# Altium schematic sheet GPIOs RPI CM.SchDoc
size A3; SheetNumber: 1; SheetTotal: 11
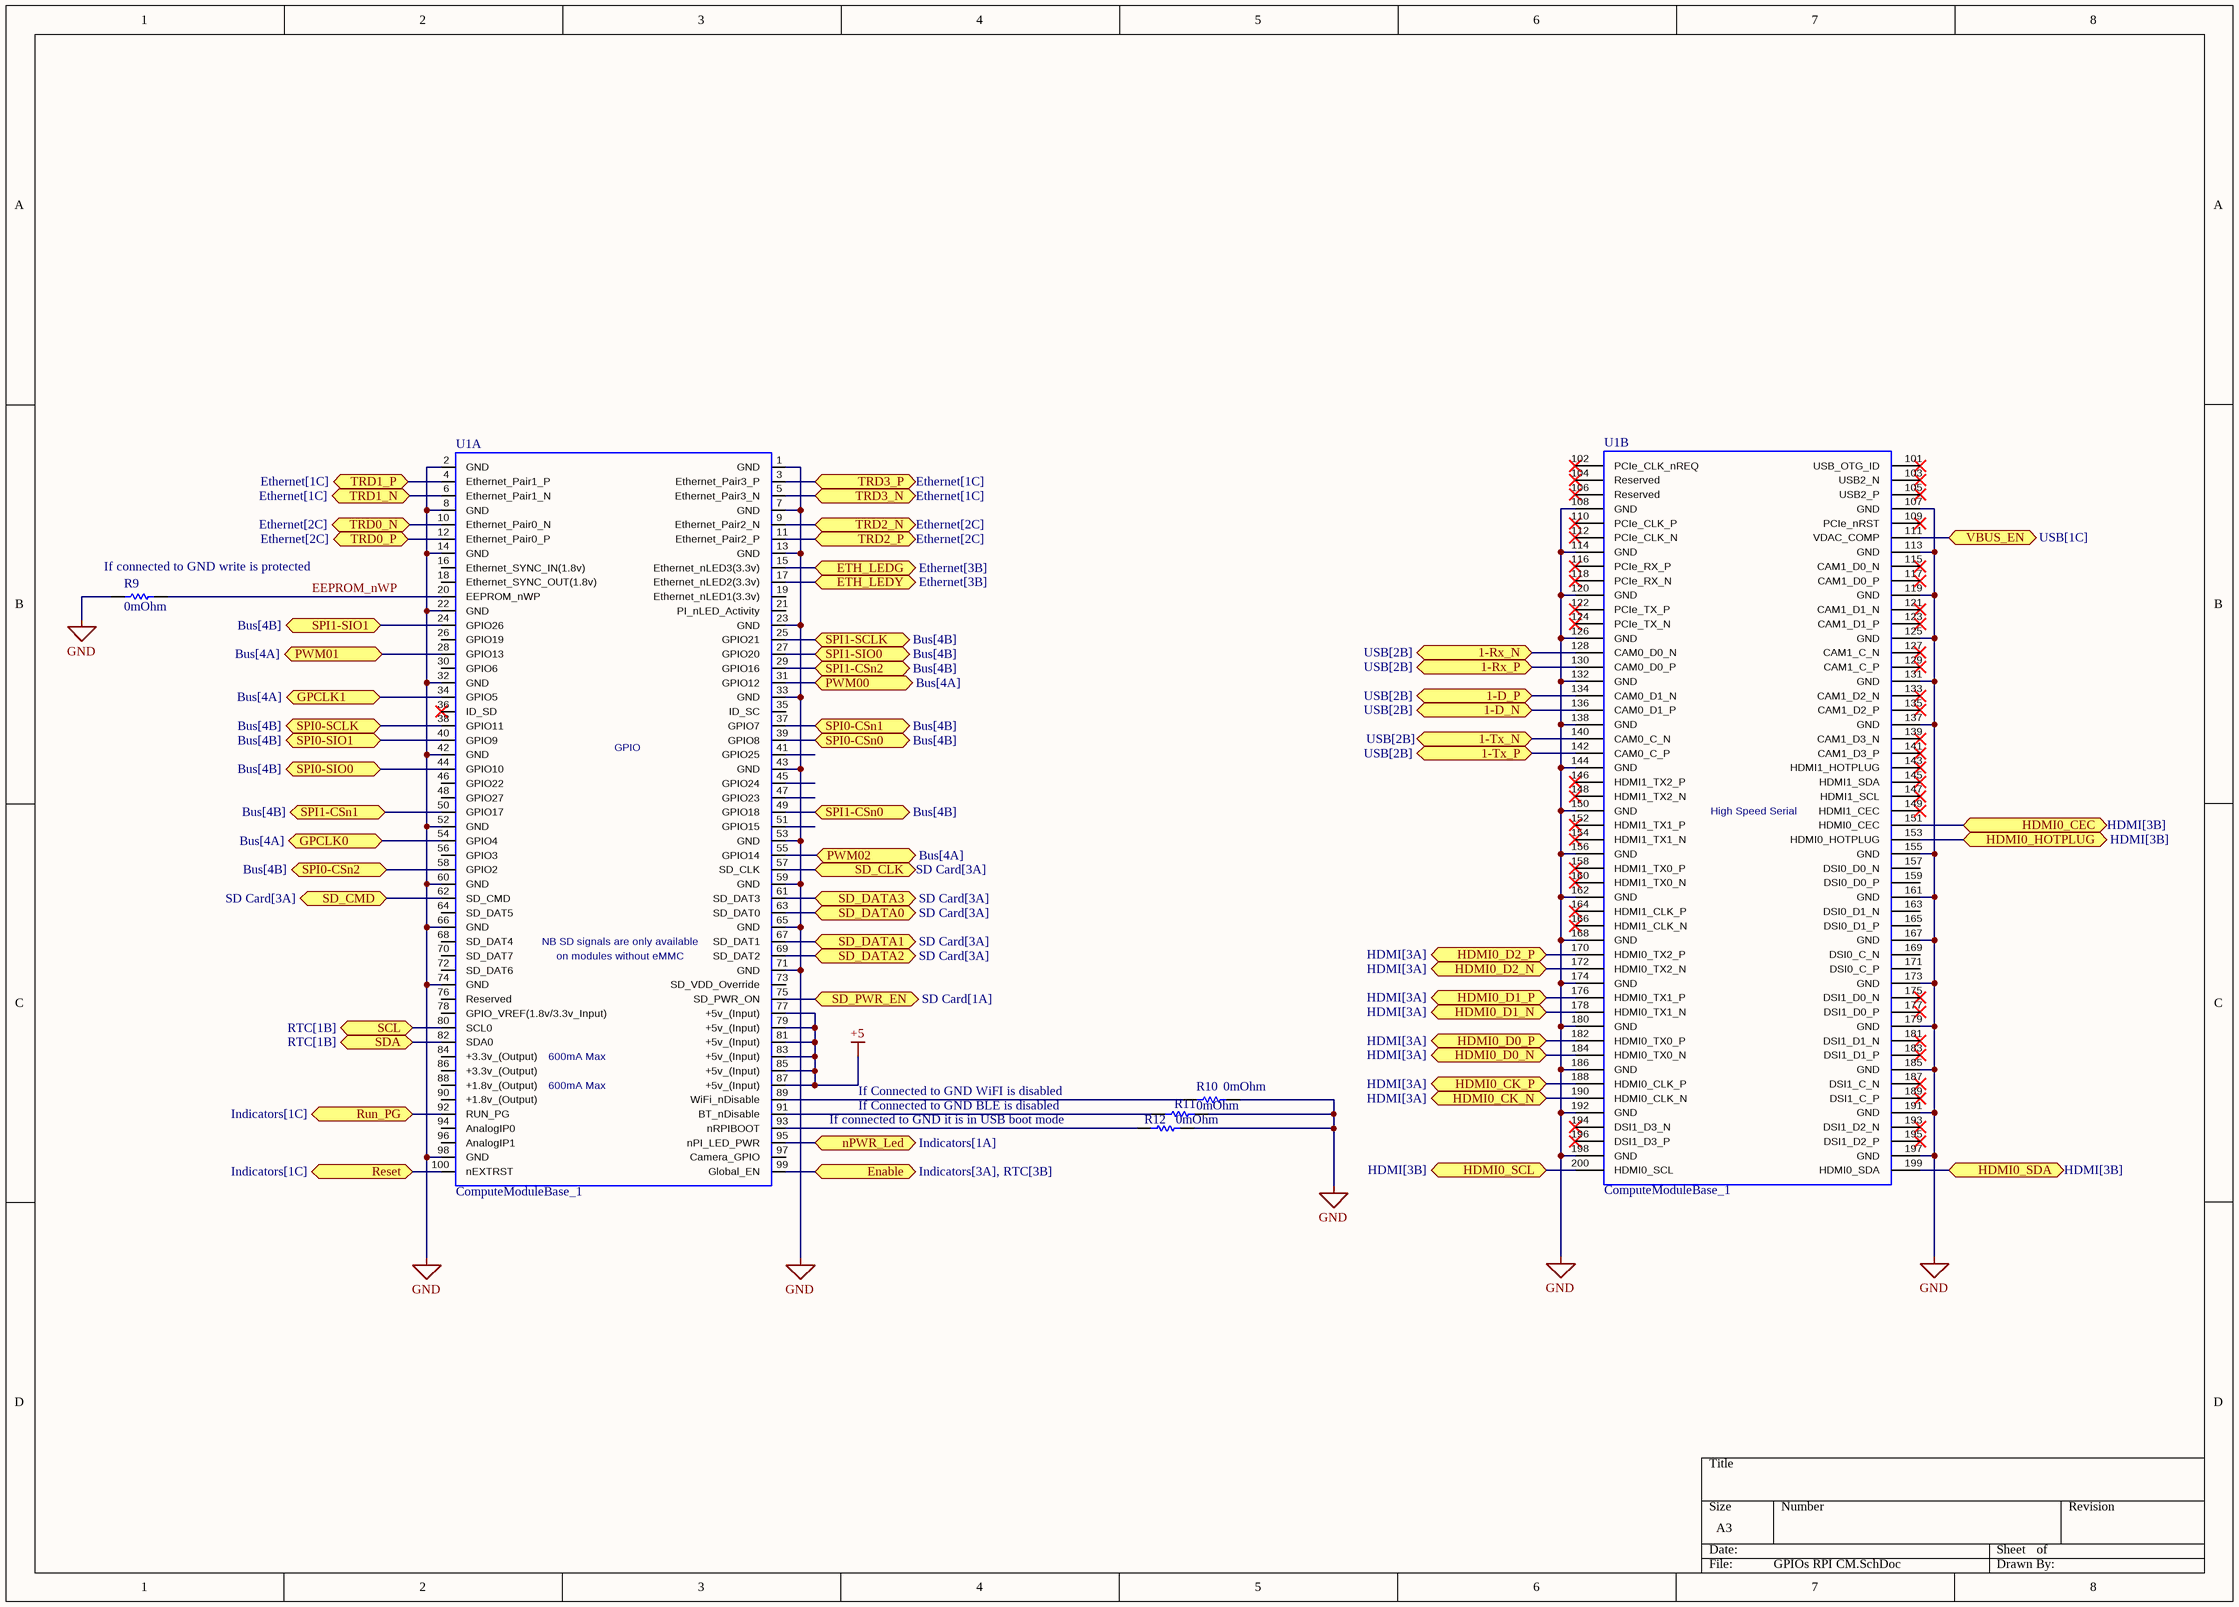
[diagram p0: GPIOs RPI CM.SchDoc]

## Parts
R9  Resistance: 0mOhm  [RESC1005X40X25LL05T05]  (hidden comment: ERJ2GE0R00X)
R10  Resistance: 0mOhm  [RESC1005X40X25LL05T05]  (hidden comment: ERJ2GE0R00X)
R11  Resistance: 0mOhm  [RESC1005X40X25LL05T05]  (hidden comment: ERJ2GE0R00X)
R12  Resistance: 0mOhm  [RESC1005X40X25LL05T05]  (hidden comment: ERJ2GE0R00X)
U1  ComputeModuleBase_1  [Raspberry-Pi-Compute-Module]  (parts A,B of 2)

## Ports
1-D_N (bidir, see USB[2B]), 1-D_P (bidir, see USB[2B]), 1-Rx_N (bidir, see USB[2B]), 1-Rx_P (bidir, see USB[2B]), 1-Tx_N (bidir, see USB[2B]), 1-Tx_P (bidir, see USB[2B]), Enable (bidir, see Indicators[3A], RTC[3B]), ETH_LEDG (bidir, see Ethernet[3B]), ETH_LEDY (bidir, see Ethernet[3B]), GPCLK0 (bidir, see Bus[4A]), GPCLK1 (bidir, see Bus[4A]), HDMI0_CEC (bidir, see HDMI[3B]), HDMI0_CK_N (bidir, see HDMI[3A]), HDMI0_CK_P (bidir, see HDMI[3A]), HDMI0_D0_N (bidir, see HDMI[3A]), HDMI0_D0_P (bidir, see HDMI[3A]), HDMI0_D1_N (bidir, see HDMI[3A]), HDMI0_D1_P (bidir, see HDMI[3A]), HDMI0_D2_N (bidir, see HDMI[3A]), HDMI0_D2_P (bidir, see HDMI[3A]), HDMI0_HOTPLUG (bidir, see HDMI[3B]), HDMI0_SCL (bidir, see HDMI[3B]), HDMI0_SDA (bidir, see HDMI[3B]), nPWR_Led (bidir, see Indicators[1A]), PWM00 (bidir, see Bus[4A]), PWM01 (bidir, see Bus[4A]), PWM02 (bidir, see Bus[4A]), Reset (bidir, see Indicators[1C]), Run_PG (bidir, see Indicators[1C]), SCL (bidir, see RTC[1B]), SD_CLK (bidir, see SD Card[3A]), SD_CMD (bidir, see SD Card[3A]), SD_DATA0 (bidir, see SD Card[3A]), SD_DATA1 (bidir, see SD Card[3A]), SD_DATA2 (bidir, see SD Card[3A]), SD_DATA3 (bidir, see SD Card[3A]), SD_PWR_EN (bidir, see SD Card[1A]), SDA (bidir, see RTC[1B]), SPI0-CSn0 (bidir, see Bus[4B]), SPI0-CSn1 (bidir, see Bus[4B]), SPI0-CSn2 (bidir, see Bus[4B]), SPI0-SCLK (bidir, see Bus[4B]), SPI0-SIO0 (bidir, see Bus[4B]), SPI0-SIO1 (bidir, see Bus[4B]), SPI1-CSn0 (bidir, see Bus[4B]), SPI1-CSn1 (bidir, see Bus[4B]), SPI1-CSn2 (bidir, see Bus[4B]), SPI1-SCLK (bidir, see Bus[4B]), SPI1-SIO0 (bidir, see Bus[4B]), SPI1-SIO1 (bidir, see Bus[4B]), TRD0_N (bidir, see Ethernet[2C]), TRD0_P (bidir, see Ethernet[2C]), TRD1_N (bidir, see Ethernet[1C]), TRD1_P (bidir, see Ethernet[1C]), TRD2_N (bidir, see Ethernet[2C]), TRD2_P (bidir, see Ethernet[2C]), TRD3_N (bidir, see Ethernet[1C]), TRD3_P (bidir, see Ethernet[1C]), VBUS_EN (bidir, see USB[1C])

## Nets
+5: U1.77(+5v_(Input)) U1.79(+5v_(Input)) U1.81(+5v_(Input)) U1.83(+5v_(Input)) U1.85(+5v_(Input)) U1.87(+5v_(Input))
GND: R9.2 R10.2 R11.2 R12.2 U1.1(GND) U1.2(GND) U1.7(GND) U1.8(GND) U1.13(GND) U1.14(GND) U1.22(GND) U1.23(GND) U1.32(GND) U1.33(GND) U1.42(GND) U1.43(GND) U1.52(GND) U1.53(GND) U1.59(GND) U1.60(GND) U1.65(GND) U1.66(GND) U1.71(GND) U1.74(GND) U1.98(GND) U1.107(GND) U1.108(GND) U1.113(GND) U1.114(GND) U1.119(GND) U1.120(GND) U1.125(GND) U1.126(GND) U1.131(GND) U1.132(GND) U1.137(GND) U1.138(GND) U1.144(GND) U1.150(GND) U1.155(GND) U1.156(GND) U1.161(GND) U1.162(GND) U1.167(GND) U1.168(GND) U1.173(GND) U1.174(GND) U1.179(GND) U1.180(GND) U1.185(GND) U1.186(GND) U1.191(GND) U1.192(GND) U1.197(GND) U1.198(GND)
1-D_N: U1.136(CAM0_D1_P) ; port 1-D_N
1-D_P: U1.134(CAM0_D1_N) ; port 1-D_P
1-Rx_N: U1.128(CAM0_D0_N) ; port 1-Rx_N
1-Rx_P: U1.130(CAM0_D0_P) ; port 1-Rx_P
1-Tx_N: U1.140(CAM0_C_N) ; port 1-Tx_N
1-Tx_P: U1.142(CAM0_C_P) ; port 1-Tx_P
EEPROM_nWP: R9.1 U1.20(EEPROM_nWP)
Enable: U1.99(Global_EN) ; port Enable
ETH_LEDG: U1.15(Ethernet_nLED3(3.3v)) ; port ETH_LEDG
ETH_LEDY: U1.17(Ethernet_nLED2(3.3v)) ; port ETH_LEDY
GPCLK0: U1.54(GPIO4) ; port GPCLK0
GPCLK1: U1.34(GPIO5) ; port GPCLK1
HDMI0_CEC: U1.151(HDMI0_CEC) ; port HDMI0_CEC
HDMI0_CK_N: U1.190(HDMI0_CLK_N) ; port HDMI0_CK_N
HDMI0_CK_P: U1.188(HDMI0_CLK_P) ; port HDMI0_CK_P
HDMI0_D0_N: U1.184(HDMI0_TX0_N) ; port HDMI0_D0_N
HDMI0_D0_P: U1.182(HDMI0_TX0_P) ; port HDMI0_D0_P
HDMI0_D1_N: U1.178(HDMI0_TX1_N) ; port HDMI0_D1_N
HDMI0_D1_P: U1.176(HDMI0_TX1_P) ; port HDMI0_D1_P
HDMI0_D2_N: U1.172(HDMI0_TX2_N) ; port HDMI0_D2_N
HDMI0_D2_P: U1.170(HDMI0_TX2_P) ; port HDMI0_D2_P
HDMI0_HOTPLUG: U1.153(HDMI0_HOTPLUG) ; port HDMI0_HOTPLUG
HDMI0_SCL: U1.200(HDMI0_SCL) ; port HDMI0_SCL
HDMI0_SDA: U1.199(HDMI0_SDA) ; port HDMI0_SDA
nPWR_Led: U1.95(nPI_LED_PWR) ; port nPWR_Led
PWM00: U1.31(GPIO12) ; port PWM00
PWM01: U1.28(GPIO13) ; port PWM01
PWM02: U1.55(GPIO14) ; port PWM02
Reset: U1.100(nEXTRST) ; port Reset
Run_PG: U1.92(RUN_PG) ; port Run_PG
SCL: U1.80(SCL0) ; port SCL
SD_CLK: U1.57(SD_CLK) ; port SD_CLK
SD_CMD: U1.62(SD_CMD) ; port SD_CMD
SD_DATA0: U1.63(SD_DAT0) ; port SD_DATA0
SD_DATA1: U1.67(SD_DAT1) ; port SD_DATA1
SD_DATA2: U1.69(SD_DAT2) ; port SD_DATA2
SD_DATA3: U1.61(SD_DAT3) ; port SD_DATA3
SD_PWR_EN: U1.75(SD_PWR_ON) ; port SD_PWR_EN
SDA: U1.82(SDA0) ; port SDA
SPI0-CSn0: U1.39(GPIO8) ; port SPI0-CSn0
SPI0-CSn1: U1.37(GPIO7) ; port SPI0-CSn1
SPI0-CSn2: U1.58(GPIO2) ; port SPI0-CSn2
SPI0-SCLK: U1.38(GPIO11) ; port SPI0-SCLK
SPI0-SIO0: U1.44(GPIO10) ; port SPI0-SIO0
SPI0-SIO1: U1.40(GPIO9) ; port SPI0-SIO1
SPI1-CSn0: U1.49(GPIO18) ; port SPI1-CSn0
SPI1-CSn1: U1.50(GPIO17) ; port SPI1-CSn1
SPI1-CSn2: U1.29(GPIO16) ; port SPI1-CSn2
SPI1-SCLK: U1.25(GPIO21) ; port SPI1-SCLK
SPI1-SIO0: U1.27(GPIO20) ; port SPI1-SIO0
SPI1-SIO1: U1.24(GPIO26) ; port SPI1-SIO1
TRD0_N: U1.10(Ethernet_Pair0_N) ; port TRD0_N
TRD0_P: U1.12(Ethernet_Pair0_P) ; port TRD0_P
TRD1_N: U1.6(Ethernet_Pair1_N) ; port TRD1_N
TRD1_P: U1.4(Ethernet_Pair1_P) ; port TRD1_P
TRD2_N: U1.9(Ethernet_Pair2_N) ; port TRD2_N
TRD2_P: U1.11(Ethernet_Pair2_P) ; port TRD2_P
TRD3_N: U1.5(Ethernet_Pair3_N) ; port TRD3_N
TRD3_P: U1.3(Ethernet_Pair3_P) ; port TRD3_P
VBUS_EN: U1.111(VDAC_COMP) ; port VBUS_EN
NetR10_1: R10.1 U1.89(WiFi_nDisable)
NetR11_1: R11.1 U1.91(BT_nDisable)
NetR12_1: R12.1 U1.93(nRPIBOOT)

Not connected (* = marked no-connect by the designer): U1 16(Ethernet_SYNC_IN(1.8v)) 18(Ethernet_SYNC_OUT(1.8v)) 19(Ethernet_nLED1(3.3v)) 21(PI_nLED_Activity) 26(GPIO19) 30(GPIO6) 35(ID_SC) 36(ID_SD)* 41(GPIO25) 45(GPIO24) 46(GPIO22) 47(GPIO23) 48(GPIO27) 51(GPIO15) 56(GPIO3) 64(SD_DAT5) 68(SD_DAT4) 70(SD_DAT7) 72(SD_DAT6) 73(SD_VDD_Override) 76(Reserved) 78(GPIO_VREF(1.8v/3.3v_Input)) 84(+3.3v_(Output)) 86(+3.3v_(Output)) 88(+1.8v_(Output)) 90(+1.8v_(Output)) 94(AnalogIP0) 96(AnalogIP1) 97(Camera_GPIO) 101(USB_OTG_ID)* 102(PCIe_CLK_nREQ)* 103(USB2_N)* 104(Reserved)* 105(USB2_P)* 106(Reserved)* 109(PCIe_nRST)* 110(PCIe_CLK_P)* 112(PCIe_CLK_N)* 115(CAM1_D0_N)* 116(PCIe_RX_P)* 117(CAM1_D0_P)* 118(PCIe_RX_N)* 121(CAM1_D1_N)* 122(PCIe_TX_P)* 123(CAM1_D1_P)* 124(PCIe_TX_N)* 127(CAM1_C_N)* 129(CAM1_C_P)* 133(CAM1_D2_N)* 135(CAM1_D2_P)* 139(CAM1_D3_N)* 141(CAM1_D3_P)* 143(HDMI1_HOTPLUG)* 145(HDMI1_SDA)* 146(HDMI1_TX2_P)* 147(HDMI1_SCL)* 148(HDMI1_TX2_N)* 149(HDMI1_CEC)* 152(HDMI1_TX1_P)* 154(HDMI1_TX1_N)* 157(DSI0_D0_N) 158(HDMI1_TX0_P)* 159(DSI0_D0_P) 160(HDMI1_TX0_N)* 163(DSI0_D1_N) 164(HDMI1_CLK_P)* 165(DSI0_D1_P) 166(HDMI1_CLK_N)* 169(DSI0_C_N) 171(DSI0_C_P) 175(DSI1_D0_N)* 177(DSI1_D0_P)* 181(DSI1_D1_N)* 183(DSI1_D1_P)* 187(DSI1_C_N)* 189(DSI1_C_P)* 193(DSI1_D2_N)* 194(DSI1_D3_N)* 195(DSI1_D2_P)* 196(DSI1_D3_P)*

## Notes on the sheet
- (near R9) If connected to GND write is protected
- If connected to GND it is in USB boot mode
- If Connected to GND WiFI is disabled
- If Connected to GND BLE is disabled
- (in symbol ComputeModuleBase_1, part A) GPIO; NB SD signals are only available; on modules without eMMC; 600mA Max
- (in symbol ComputeModuleBase_1, part B) High Speed Serial

## Library data of the parts
R9-R12 = CMP-2000-07451-1: Chip Resistor, 0 Ohm, 0.1 W, -55 to 155 degC, 0402 (1005 Metric), RoHS, Tape and Reel; Manufacturer: Panasonic; Voltage Rating (DC): 50V; Temperature Coefficient: 600ppm/��C; Max Power Dissipation: 100mW; Tolerance: 5%; Number of Terminations: 2; Mount: SurfaceMount; Height: 0.35mm; Packaging: TapeandReel; Contact Plating: Tin; Manufacturer URL: http://www.panasonic.com/; Composition: ThickFilm; Max Operating Temperature: 155degC; REACH SVHC: NoSVHC; Case/Package: 0402; Package Reference: 402; Depth: 0.5mm; Package Description: 2-Pin Surface Mount Device, Body 1 x 0.5 mm; Datasheet URL: https://industrial.panasonic.com/cdbs/www-data/pdf/RDA0000/AOA0000C301.pdf; RoHSCompliant: True; Case Code (Imperial): 0402; Military Standard: Not; Min Operating Temperature: -55degC; Power Rating: 100mW; Datasheet Version: 03/2015; Length: 1mm; Case Code (Metric): 1005; Termination: SMD/SMT; Mounting Technology: SurfaceMount; Voltage Rating: 50V; Width: 0.02inch; Package Quantity: 1; Lead Free: LeadFree; Radiation Hardening: No
U1 = ComputeModuleBase_1: Compute Module Holder